# Altium schematic sheet ECG_mesurment_2.SchDoc
size 594 x 420 mm; SheetNumber: 1; SheetTotal: 2
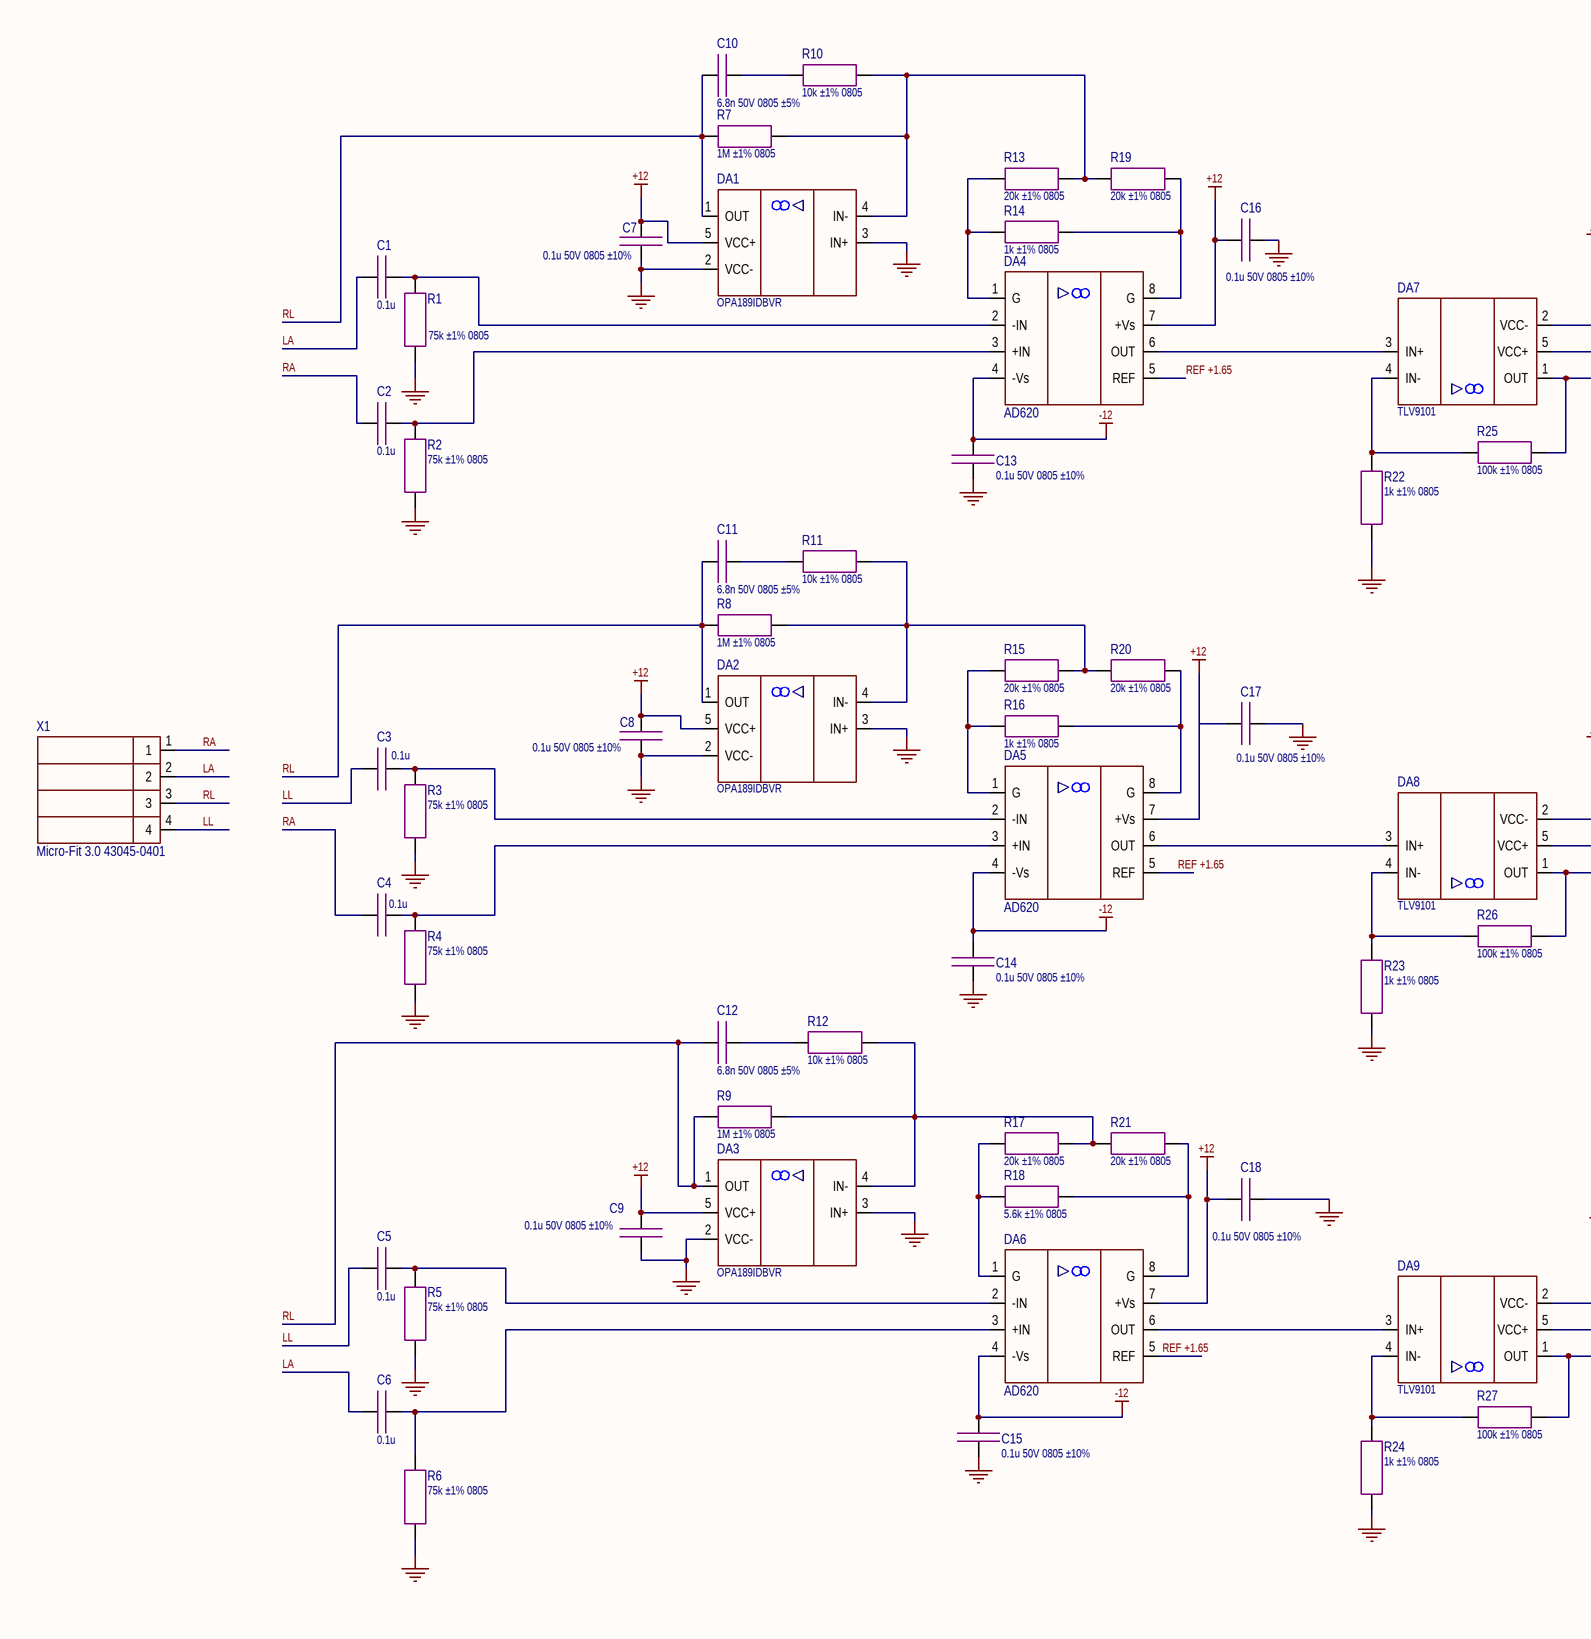
[diagram p0: ECG_mesurment_2.SchDoc, left]
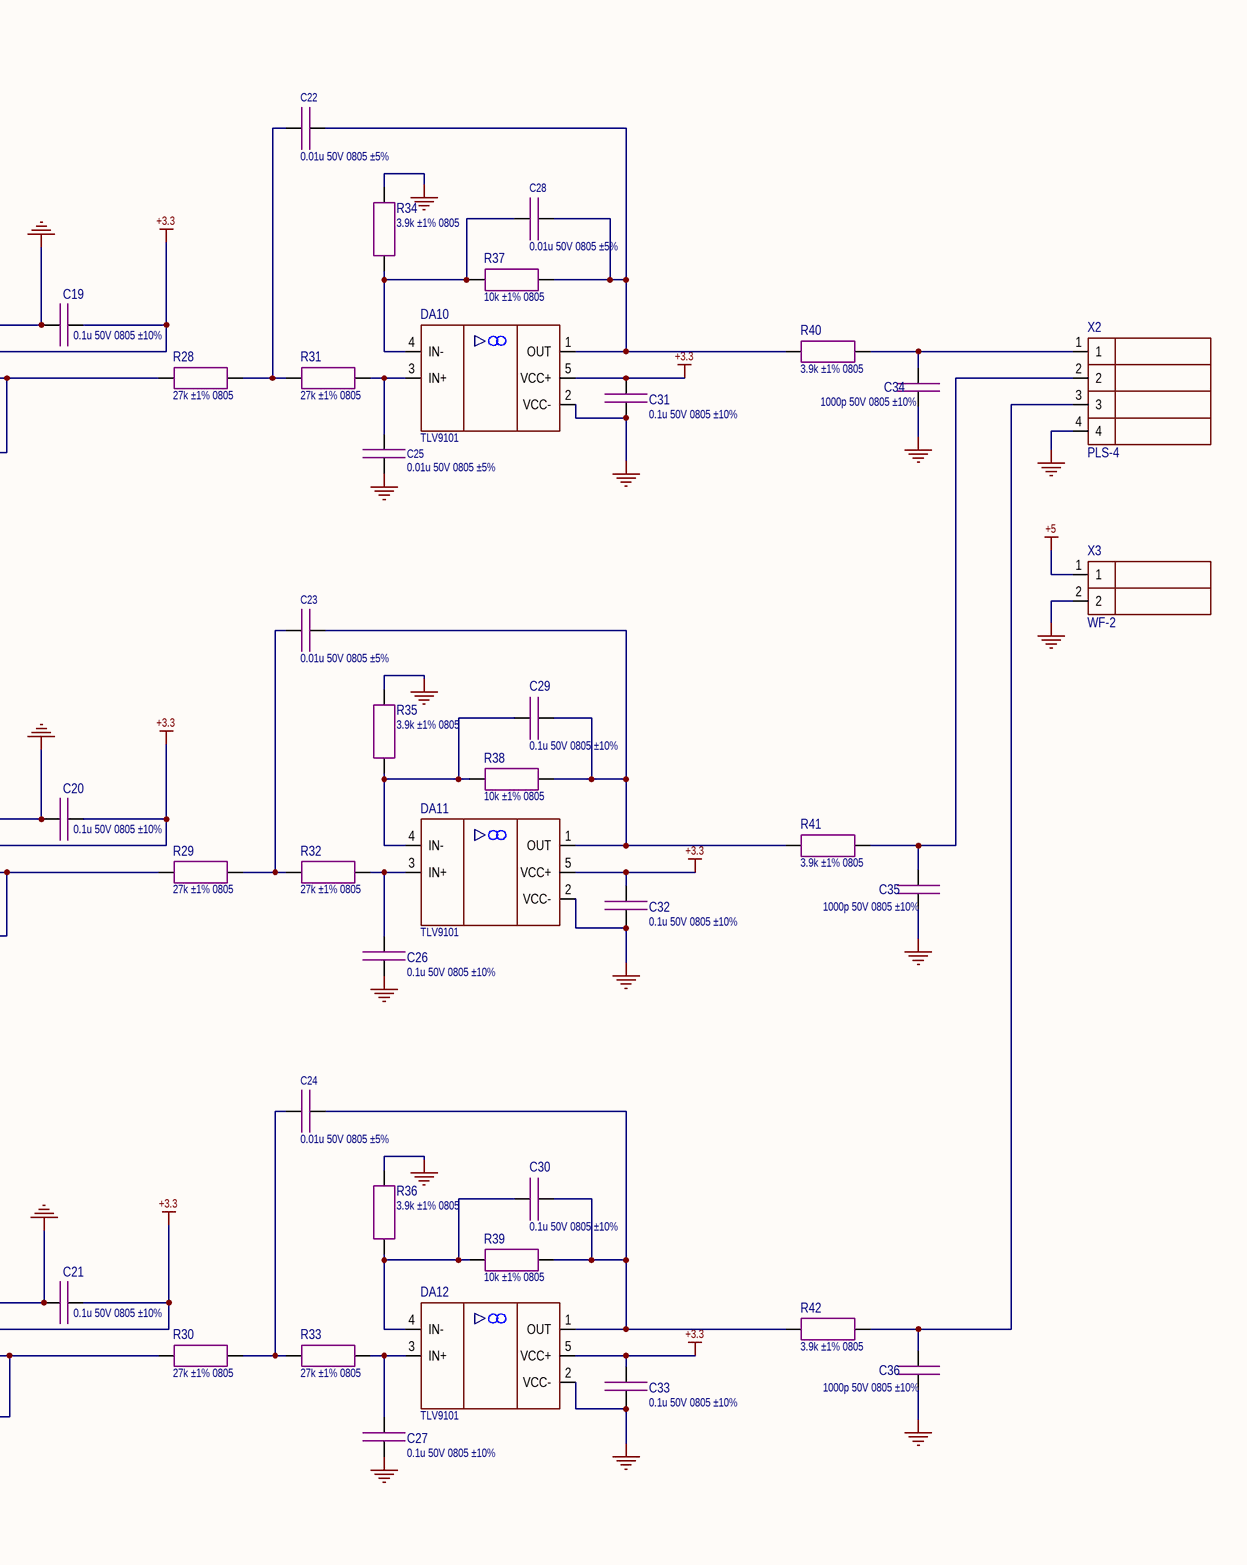
[diagram p1: ECG_mesurment_2.SchDoc, right]

## Parts
C1  0.1u  [CAP: SMD 0805 MD IPC 782]
C2  0.1u  [CAP: SMD 0805 MD IPC 782]
C3  0.1u  [CAP: SMD 0805 MD IPC 782]
C4  0.1u  [CAP: SMD 0805 MD IPC 782]
C5  0.1u  [CAP: SMD 0805 MD IPC 782]
C6  0.1u  [CAP: SMD 0805 MD IPC 782]
C7  0.1u 50V 0805 ±10%  [CAP: SMD 0805 MD IPC 782]
C8  0.1u 50V 0805 ±10%  [CAP: SMD 0805 MD IPC 782]
C9  0.1u 50V 0805 ±10%  [CAP: SMD 0805 MD IPC 782]
C10  6.8n 50V 0805 ±5%  [CAP: SMD 0805 MD IPC 782]
C11  6.8n 50V 0805 ±5%  [CAP: SMD 0805 MD IPC 782]
C12  6.8n 50V 0805 ±5%  [CAP: SMD 0805 MD IPC 782]
C13  0.1u 50V 0805 ±10%  [CAP: SMD 0805 MD IPC 782]
C14  0.1u 50V 0805 ±10%  [CAP: SMD 0805 MD IPC 782]
C15  0.1u 50V 0805 ±10%  [CAP: SMD 0805 MD IPC 782]
C16  0.1u 50V 0805 ±10%  [CAP: SMD 0805 MD IPC 782]
C17  0.1u 50V 0805 ±10%  [CAP: SMD 0805 MD IPC 782]
C18  0.1u 50V 0805 ±10%  [CAP: SMD 0805 MD IPC 782]
C19  0.1u 50V 0805 ±10%  [CAP: SMD 0805 MD IPC 782]
C20  0.1u 50V 0805 ±10%  [CAP: SMD 0805 MD IPC 782]
C21  0.1u 50V 0805 ±10%  [CAP: SMD 0805 MD IPC 782]
C22  0.01u 50V 0805 ±5%  [CAP: SMD 0805 MD IPC 782]
C23  0.01u 50V 0805 ±5%  [CAP: SMD 0805 MD IPC 782]
C24  0.01u 50V 0805 ±5%  [CAP: SMD 0805 MD IPC 782]
C25  0.01u 50V 0805 ±5%  [CAP: SMD 0805 MD IPC 782]
C26  0.1u 50V 0805 ±10%  [CAP: SMD 0805 MD IPC 782]
C27  0.1u 50V 0805 ±10%  [CAP: SMD 0805 MD IPC 782]
C28  0.01u 50V 0805 ±5%  [CAP: SMD 0805 MD IPC 782]
C29  0.1u 50V 0805 ±10%  [CAP: SMD 0805 MD IPC 782]
C30  0.1u 50V 0805 ±10%  [CAP: SMD 0805 MD IPC 782]
C31  0.1u 50V 0805 ±10%  [CAP: SMD 0805 MD IPC 782]
C32  0.1u 50V 0805 ±10%  [CAP: SMD 0805 MD IPC 782]
C33  0.1u 50V 0805 ±10%  [CAP: SMD 0805 MD IPC 782]
C34  1000p 50V 0805 ±10%  [CAP: SMD 0805 MD IPC 782]
C35  1000p 50V 0805 ±10%  [CAP: SMD 0805 MD IPC 782]
C36  1000p 50V 0805 ±10%  [CAP: SMD 0805 MD IPC 782]
DA1  OPA189IDBVR  [IC: SOT 23 5pin]
DA2  OPA189IDBVR  [IC: SOT 23 5pin]
DA3  OPA189IDBVR  [IC: SOT 23 5pin]
DA4  AD620  [IC: SOIC 8]
DA5  AD620  [IC: SOIC 8]
DA6  AD620  [IC: SOIC 8]
DA7  TLV9101  [IC: SOT 23 5pin]
DA8  TLV9101  [IC: SOT 23 5pin]
DA9  TLV9101  [IC: SOT 23 5pin]
DA10  TLV9101  [IC: SOT 23 5pin]
DA11  TLV9101  [IC: SOT 23 5pin]
DA12  TLV9101  [IC: SOT 23 5pin]
R1  75k ±1% 0805  [RES: SMD 0805 MD IPC 782]
R2  75k ±1% 0805  [RES: SMD 0805 MD IPC 782]
R3  75k ±1% 0805  [RES: SMD 0805 MD IPC 782]
R4  75k ±1% 0805  [RES: SMD 0805 MD IPC 782]
R5  75k ±1% 0805  [RES: SMD 0805 MD IPC 782]
R6  75k ±1% 0805  [RES: SMD 0805 MD IPC 782]
R7  1M ±1% 0805  [RES: SMD 0805 MD IPC 782]
R8  1M ±1% 0805  [RES: SMD 0805 MD IPC 782]
R9  1M ±1% 0805  [RES: SMD 0805 MD IPC 782]
R10  10k ±1% 0805  [RES: SMD 0805 MD IPC 782]
R11  10k ±1% 0805  [RES: SMD 0805 MD IPC 782]
R12  10k ±1% 0805  [RES: SMD 0805 MD IPC 782]
R13  20k ±1% 0805  [RES: SMD 0805 MD IPC 782]
R14  1k ±1% 0805  [RES: SMD 0805 MD IPC 782]
R15  20k ±1% 0805  [RES: SMD 0805 MD IPC 782]
R16  1k ±1% 0805  [RES: SMD 0805 MD IPC 782]
R17  20k ±1% 0805  [RES: SMD 0805 MD IPC 782]
R18  5.6k ±1% 0805  [RES: SMD 0805 MD IPC 782]
R19  20k ±1% 0805  [RES: SMD 0805 MD IPC 782]
R20  20k ±1% 0805  [RES: SMD 0805 MD IPC 782]
R21  20k ±1% 0805  [RES: SMD 0805 MD IPC 782]
R22  1k ±1% 0805  [RES: SMD 0805 MD IPC 782]
R23  1k ±1% 0805  [RES: SMD 0805 MD IPC 782]
R24  1k ±1% 0805  [RES: SMD 0805 MD IPC 782]
R25  100k ±1% 0805  [RES: SMD 0805 MD IPC 782]
R26  100k ±1% 0805  [RES: SMD 0805 MD IPC 782]
R27  100k ±1% 0805  [RES: SMD 0805 MD IPC 782]
R28  27k ±1% 0805  [RES: SMD 0805 MD IPC 782]
R29  27k ±1% 0805  [RES: SMD 0805 MD IPC 782]
R30  27k ±1% 0805  [RES: SMD 0805 MD IPC 782]
R31  27k ±1% 0805  [RES: SMD 0805 MD IPC 782]
R32  27k ±1% 0805  [RES: SMD 0805 MD IPC 782]
R33  27k ±1% 0805  [RES: SMD 0805 MD IPC 782]
R34  3.9k ±1% 0805  [RES: SMD 0805 MD IPC 782]
R35  3.9k ±1% 0805  [RES: SMD 0805 MD IPC 782]
R36  3.9k ±1% 0805  [RES: SMD 0805 MD IPC 782]
R37  10k ±1% 0805  [RES: SMD 0805 MD IPC 782]
R38  10k ±1% 0805  [RES: SMD 0805 MD IPC 782]
R39  10k ±1% 0805  [RES: SMD 0805 MD IPC 782]
R40  3.9k ±1% 0805  [RES: SMD 0805 MD IPC 782]
R41  3.9k ±1% 0805  [RES: SMD 0805 MD IPC 782]
R42  3.9k ±1% 0805  [RES: SMD 0805 MD IPC 782]
X1  Micro-Fit 3.0 43045-0401  [CON: 4pin Molex MicroFit 3.0 43045-0401]
X2  PLS-4  [CON: 4pin PLS-4]
X3  WF-2  [CON: 2pin wf-2]

## Nets
+3.3: C19.1 C20.1 C21.1 C31.1 C32.1 C33.1 DA7.5(VCC+) DA8.5(VCC+) DA9.5(VCC+) DA10.5(VCC+) DA11.5(VCC+) DA12.5(VCC+)
+5: X3.1
+12: C7.1 C8.1 C9.1 C16.1 C17.1 C18.1 DA1.5(VCC+) DA2.5(VCC+) DA3.5(VCC+) DA4.7(+Vs) DA5.7(+Vs) DA6.7(+Vs)
-12: C13.1 C14.1 C15.1 DA4.4(-Vs) DA5.4(-Vs) DA6.4(-Vs)
GND: C7.2 C8.2 C9.2 C13.2 C14.2 C15.2 C16.2 C17.2 C18.2 C19.2 C20.2 C21.2 C25.2 C26.1 C27.1 C31.2 C32.2 C33.2 C34.2 C35.2 C36.2 DA1.2(VCC-) DA1.3(IN+) DA2.2(VCC-) DA2.3(IN+) DA3.2(VCC-) DA3.3(IN+) DA7.2(VCC-) DA8.2(VCC-) DA9.2(VCC-) DA10.2(VCC-) DA11.2(VCC-) DA12.2(VCC-) R1.1 R2.1 R3.1 R4.1 R5.1 R6.1 R22.2 R23.2 R24.2 R34.2 R35.2 R36.2 X2.4 X3.2
LA: C1.2 C6.2 X1.2
LL: C3.2 C5.2 X1.4
RA: C2.2 C4.2 X1.1
REF +1.65: DA4.5(REF) DA5.5(REF) DA6.5(REF)
RL: C10.2 C11.2 C12.2 DA1.1(OUT) DA2.1(OUT) DA3.1(OUT) R7.1 R8.1 R9.1 X1.3
NetC1_1: C1.1 DA4.2(-IN) R1.2
NetC2_1: C2.1 DA4.3(+IN) R2.2
NetC3_1: C3.1 DA5.2(-IN) R3.2
NetC4_1: C4.1 DA5.3(+IN) R4.2
NetC5_1: C5.1 DA6.2(-IN) R5.2
NetC6_1: C6.1 DA6.3(+IN) R6.2
NetC10_1: C10.1 R10.1
NetC11_1: C11.1 R11.1
NetC12_1: C12.1 R12.1
NetC22_1: C22.1 C28.1 DA10.1(OUT) R37.2 R40.1
NetC22_2: C22.2 R28.2 R31.1
NetC23_1: C23.1 C29.1 DA11.1(OUT) R38.2 R41.1
NetC23_2: C23.2 R29.2 R32.1
NetC24_1: C24.1 C30.1 DA12.1(OUT) R39.2 R42.1
NetC24_2: C24.2 R30.2 R33.1
NetC25_1: C25.1 DA10.3(IN+) R31.2
NetC26_2: C26.2 DA11.3(IN+) R32.2
NetC27_2: C27.2 DA12.3(IN+) R33.2
NetC28_2: C28.2 DA10.4(IN-) R34.1 R37.1
NetC29_2: C29.2 DA11.4(IN-) R35.1 R38.1
NetC30_2: C30.2 DA12.4(IN-) R36.1 R39.1
NetC34_1: C34.1 R40.2 X2.1
NetC35_1: C35.1 R41.2 X2.2
NetC36_1: C36.1 R42.2 X2.3
NetDA1_4: DA1.4(IN-) R7.2 R10.2 R13.2 R19.1
NetDA2_4: DA2.4(IN-) R8.2 R11.2 R15.2 R20.1
NetDA3_4: DA3.4(IN-) R9.2 R12.2 R17.2 R21.1
NetDA4_1: DA4.1(G) R13.1 R14.1
NetDA4_6: DA4.6(OUT) DA7.3(IN+)
NetDA4_8: DA4.8(G) R14.2 R19.2
NetDA5_1: DA5.1(G) R15.1 R16.1
NetDA5_6: DA5.6(OUT) DA8.3(IN+)
NetDA5_8: DA5.8(G) R16.2 R20.2
NetDA6_1: DA6.1(G) R17.1 R18.1
NetDA6_6: DA6.6(OUT) DA9.3(IN+)
NetDA6_8: DA6.8(G) R18.2 R21.2
NetDA7_1: DA7.1(OUT) R25.2 R28.1
NetDA7_4: DA7.4(IN-) R22.1 R25.1
NetDA8_1: DA8.1(OUT) R26.2 R29.1
NetDA8_4: DA8.4(IN-) R23.1 R26.1
NetDA9_1: DA9.1(OUT) R27.2 R30.1
NetDA9_4: DA9.4(IN-) R24.1 R27.1

## Notes on the sheet
- Перв. примен.
- Справ. №
- Подп. и дата
- Инв. № дубл.
- Взам. инв. №
- Разраб.
- Изм.
- Лист
- № докум.
- Подп.
- Дата
- Лит.
- Масса
- Масштаб
- Пров.
- Т.контр.
- Листов
- Инв. № подл.
- Утв.
- Н.контр.
- 2.106-A2
- Копировал
- Формат А2

## Library data of the parts
C1-C9 C13-C21 C26 C27 C29-C36 = 0.1u 50V 0805 ±10%: Code: 6279254871; Name: Конденсатор X7R 50V 0,1uF ±10% 0805
C10-C12 = 6.8n 50V 0805 ±5%: Code: 6279352311; Name: Конденсатор NPO 50V 6800pF ±5% 0805
C22-C25 C28 = 0.01u 50V 0805 ±5%: Code: 6279261451; Name: Конденсатор X7R 50V  0,01uF±5%  0805
DA1-DA3 = OPA189IDBVR: Name: Микросхема OPA189IDBVR
DA7-DA12 = TLV9101: Code: 6339115821; Name: Микросхема TLV9101IDBVR
R1-R6 R40-R42 = 75k ±1% 0805: Name: Резистор 75К±1% 0805
R7-R9 = 1M ±1% 0805: Name: Резистор RC0805FR-071KL, Yageo
R10-R12 R37 = 10k ±1% 0805: Code: 6020003061; Name: Резистор RC0805JR-0710KL
R13 R15 R17 R19-R21 = 20k ±1% 0805: Code: 6094357581; Name: Резистор 20K±1% 0805
R14 R16 R18 = 1k ±1% 0805: Code: 6027158691; Name: Резистор RC0805FR-071KL, Yageo
R22-R27 R34-R36 R38 R39 = 100k ±1% 0805: Code: 6094357811; Name: Резистор 100K±1% 0805
R28-R33 = 27k ±1% 0805: Name: Резистор 27k±1% 0805
X1 = 4 pin MicroFit DR R Molex: Code: *; Name: *
X2 = 4 pin PLS-4: Code: 6313932041; Name: Вилка WF-4
X3 = 2 pin WF-2: Code: 6313952902; Name: Вилка WF-2